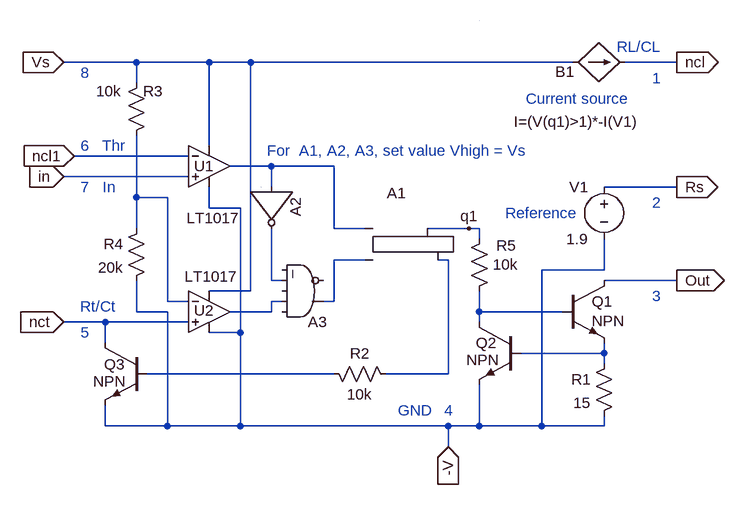
[diagram p0: schematic LM331m1.asc]
LM331m1.asc, the LTspice schematic file:
Version 4
SHEET 1 1364 772
WIRE -64 32 -176 32
WIRE 48 32 -64 32
WIRE 112 32 48 32
WIRE 608 32 112 32
WIRE 768 32 688 32
WIRE -64 64 -64 32
WIRE 48 160 48 32
WIRE 16 176 -160 176
WIRE 144 192 80 192
WIRE 240 192 144 192
WIRE 16 208 -176 208
WIRE 144 224 144 192
WIRE 768 224 656 224
WIRE -64 240 -64 144
WIRE -16 240 -64 240
WIRE 48 256 48 224
WIRE 96 256 48 256
WIRE -64 288 -64 240
WIRE 240 288 240 192
WIRE 288 288 240 288
WIRE 448 288 384 288
WIRE 464 288 448 288
WIRE 464 304 464 288
WIRE 288 336 240 336
WIRE 416 336 400 336
WIRE 656 352 656 304
WIRE 656 352 560 352
WIRE 144 368 144 288
WIRE 160 368 144 368
WIRE 768 368 656 368
WIRE 112 384 112 32
WIRE 112 384 48 384
WIRE -16 400 -16 240
WIRE 16 400 -16 400
WIRE 160 400 144 400
WIRE 240 400 240 336
WIRE 240 400 224 400
WIRE -64 416 -64 368
WIRE -16 416 -64 416
WIRE 144 416 144 400
WIRE 144 416 80 416
WIRE 464 416 464 384
WIRE 592 416 464 416
WIRE -112 432 -176 432
WIRE 16 432 -112 432
WIRE 464 432 464 416
WIRE 96 448 96 256
WIRE 96 448 48 448
WIRE -112 464 -112 432
WIRE 656 480 656 464
WIRE 656 480 528 480
WIRE 656 496 656 480
WIRE 240 512 -48 512
WIRE 416 512 416 336
WIRE 416 512 320 512
WIRE -112 592 -112 560
WIRE -16 592 -16 416
WIRE -16 592 -112 592
WIRE 96 592 96 448
WIRE 96 592 -16 592
WIRE 416 592 96 592
WIRE 464 592 464 528
WIRE 464 592 416 592
WIRE 560 592 560 352
WIRE 560 592 464 592
WIRE 656 592 656 576
WIRE 656 592 560 592
WIRE 416 624 416 592
FLAG 448 288 q1
FLAG -176 208 in
IOPIN -176 208 In
FLAG 768 32 ncl
IOPIN 768 32 Out
FLAG -176 432 nct
IOPIN -176 432 In
FLAG -176 32 Vs
IOPIN -176 32 In
FLAG 768 224 Rs
IOPIN 768 224 Out
FLAG 768 368 Out
IOPIN 768 368 Out
FLAG 416 624 -V
IOPIN 416 624 In
FLAG -160 176 ncl1
IOPIN -160 176 In
SYMBOL bi 608 32 M90
WINDOW 0 30 -12 VBottom 2
WINDOW 3 76 6 VTop 2
SYMATTR InstName B1
SYMATTR Value I=(V(q1)>1)*-I(V1)
SYMBOL voltage 656 208 M0
WINDOW 123 0 0 Left 2
WINDOW 39 0 0 Left 2
SYMATTR InstName V1
SYMATTR Value 1.9
SYMBOL npn 592 368 R0
WINDOW 0 45 32 Left 2
WINDOW 3 45 62 Left 2
SYMATTR InstName Q1
SYMBOL npn 528 432 M0
WINDOW 0 37 32 Left 2
WINDOW 3 34 58 Left 2
SYMATTR InstName Q2
SYMBOL npn -48 464 M0
WINDOW 0 33 33 Left 2
WINDOW 3 32 59 Left 2
SYMATTR InstName Q3
SYMBOL res 672 480 M0
SYMATTR InstName R1
SYMATTR Value 15
SYMBOL res 224 496 M90
WINDOW 0 0 56 VBottom 2
WINDOW 3 32 56 VTop 2
SYMATTR InstName R2
SYMATTR Value 10k
SYMBOL Comparators\\LT1017 48 192 R0
WINDOW 0 -23 0 Left 2
WINDOW 3 -35 80 Left 2
SYMATTR InstName U1
SYMBOL Comparators\\LT1017 48 416 R0
WINDOW 0 -23 -2 Left 2
WINDOW 3 -38 -54 Left 2
SYMATTR InstName U2
SYMBOL Digital\\srflop 336 240 R0
WINDOW 0 -14 -7 Left 2
WINDOW 3 -14 100 Invisible 2
SYMATTR InstName A1
SYMATTR Value Vhigh=10
SYMBOL res -48 48 M0
WINDOW 0 -25 28 Left 2
WINDOW 3 39 28 Left 2
SYMATTR InstName R3
SYMATTR Value 10k
SYMBOL res -48 272 M0
SYMATTR InstName R4
SYMATTR Value 20k
SYMBOL Digital\\inv 208 224 R90
WINDOW 0 16 27 Left 2
WINDOW 3 8 58 Invisible 2
SYMATTR InstName A2
SYMATTR Value Vhigh=10
SYMBOL Digital\\and 192 448 M180
WINDOW 3 16 -2 Invisible 2
SYMATTR Value Vhigh=10
SYMATTR InstName A3
SYMBOL res 480 288 M0
WINDOW 0 -41 26 Left 2
WINDOW 3 -44 55 Left 2
SYMATTR InstName R5
SYMATTR Value 10k
TEXT 424 568 Right 2 ;4
TEXT 744 56 Right 2 ;1
TEXT 744 248 Right 2 ;2
TEXT 744 392 Right 2 ;3
TEXT -136 448 Right 2 ;5
TEXT -136 160 Right 2 ;6
TEXT -136 224 Right 2 ;7
TEXT -96 408 Right 2 ;Rt/Ct
TEXT -80 160 Right 2 ;Thr
TEXT -96 224 Right 2 ;In
TEXT 744 8 Right 2 ;RL/CL
TEXT 392 568 Right 2 ;GND
TEXT 696 88 Right 2 ;Current source
TEXT 616 264 Right 2 ;Reference
TEXT 536 168 Right 2 ;For  A1, A2, A3, set value Vhigh = Vs
TEXT -136 48 Right 2 ;8
LINE Normal 464 -32 464 -32 2

The netlist it stands for:
* LM331m1.asc
B1 Vs ncl I=(V(q1)>1)*-I(V1)
V1 Rs -V 1.9
Q1 Out N007 N008 0 NPN
Q2 N007 N008 -V 0 NPN
Q3 nct N009 -V 0 NPN
R1 N008 -V 15
R2 N009 N004 10k
XU1 in ncl1 Vs -V N001 LT1017  ; pins In+ In- V+ V- OUT
XU2 nct N002 Vs -V N006 LT1017  ; pins In+ In- V+ V- OUT
A1 N001 N003 0 0 0 N004 q1 0 SRFLOP Vhigh=10
R3 Vs N002 10k
R4 N002 -V 20k
A2 N001 0 0 0 0 N005 0 0 BUF Vhigh=10
A3 0 N006 0 N005 0 0 N003 0 AND Vhigh=10
R5 q1 N007 10k
.model NPN NPN
.model PNP PNP
.lib standard.bjt
* 4
* 1
* 2
* 3
* 5
* 6
* 7
* Rt/Ct
* Thr
* In
* RL/CL
* GND
* Current source
* Reference
* For  A1, A2, A3, set value Vhigh = Vs
* 8
.backanno
.end